# EAGLE design Plytka falownika (EAGLE 4.11)
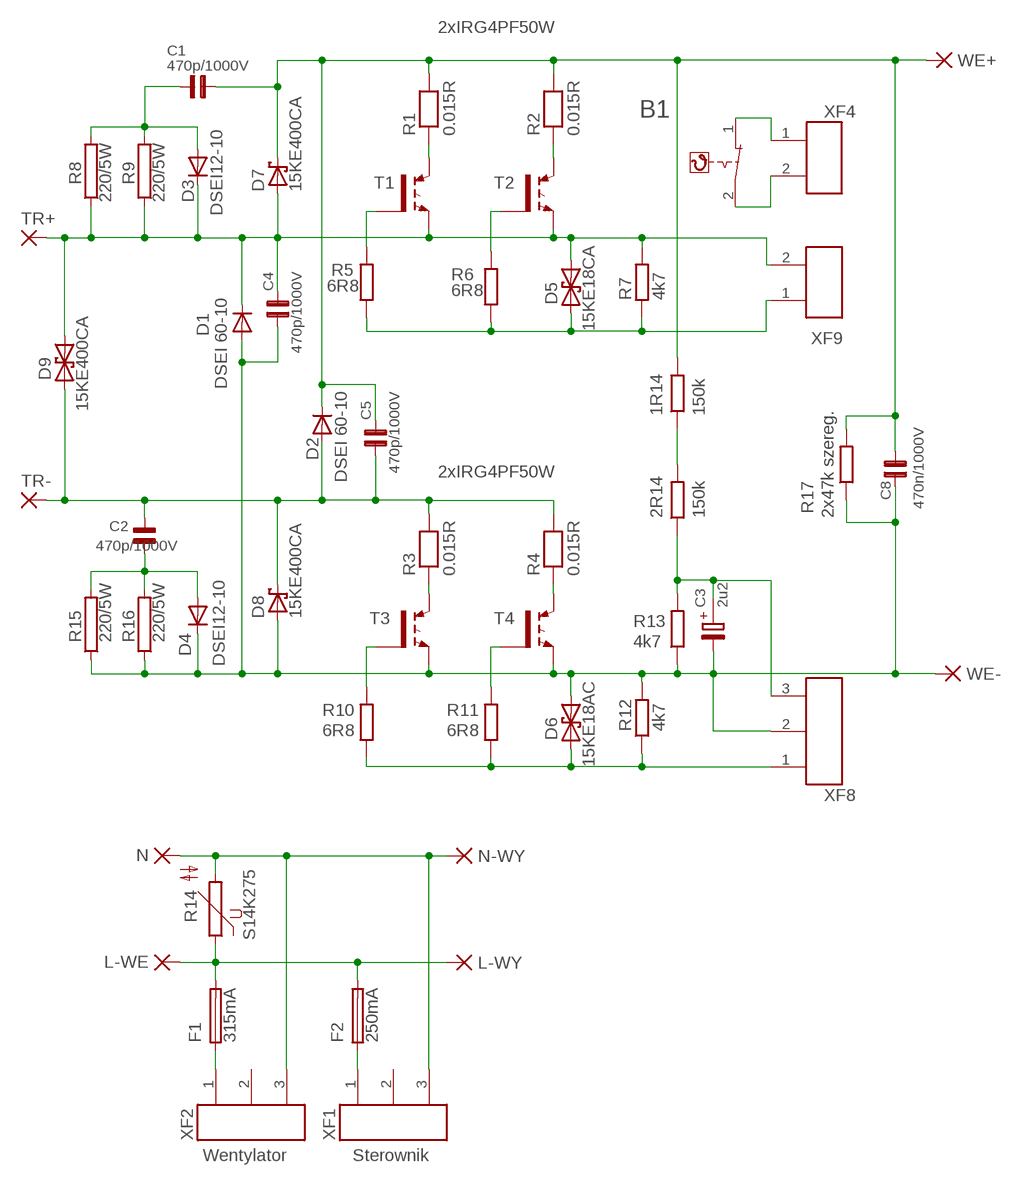
[diagram p0: schematic, sheet 1]

## Parts
1R14  150k  R-EU_0207/15  [0207/15]
2R14  150k  R-EU_0207/10  [0207/10]
B1  TGRENZ  [TGRENZ]
C1  470p/1000V  C15B5  [C15B5]
C2  470p/1000V  C15B5  [C15B5]
C3  2u2  E5-5  [E5-5]
C4  470p/1000V  C15B5  [C15B5]
C5  470p/1000V  C15B5  [C15B5]
C8  470n/1000V  C27,5B11  [C27,5B11]
D1  DSEI 60-10  DSEI60-10  [TO247AD]
D2  DSEI 60-10  DSEI60-10  [TO247AD]
D3  DSEI12-10  BYT08P  [TO220ACS]
D4  DSEI12-10  BYT08P  [TO220ACS]
D5  15KE18CA  15KEXXC  [CB429-17]
D6  15KE18AC  15KEXXC  [CB429-17]
D7  15KE400CA  15KEXX  [CB429-17]
D8  15KE400CA  15KEXX  [CB429-17]
D9  15KE400CA  15KEXXC  [CB429-17]
F1  315mA  SH22,5A  [SH22,5A]
F2  250mA  SH22,5A  [SH22,5A]
L-WE  PAD-0820  [0820]
L-WY  PAD-0820  [0820]
N  PAD-0820  [0820]
N-WY  PAD-0820  [0820]
R1  0.015R  R_BLASZ  [R_BLASZ]
R2  0.015R  R_BLASZ  [R_BLASZ]
R3  0.015R  R_BLASZ  [R_BLASZ]
R4  0.015R  R_BLASZ  [R_BLASZ]
R5  6R8  R-EU_0411/15  [0411/15]
R6  6R8  R-EU_0411/15  [0411/15]
R7  4k7  R-EU_0207/10  [0207/10]
R8  220/5W  3N2  [3N2ROYAL]
R9  220/5W  3N2  [3N2ROYAL]
R10  6R8  R-EU_0411/15  [0411/15]
R11  6R8  R-EU_0411/15  [0411/15]
R12  4k7  R-EU_0207/10  [0207/10]
R13  4k7  R-EU_0207/10  [0207/10]
R14  S14K275  [S14K275]
R15  220/5W  3N2  [3N2ROYAL]
R16  220/5W  3N2  [3N2ROYAL]
R17  2x47k szereg.  R-EU_0411/12  [0411/12]
T1  IRG4PH50U  [TO247BH]
T2  IRG4PH50U  [TO247BH]
T3  IRG4PH50U  [TO247BH]
T4  IRG4PH50U  [TO247BH]
TR+  M4_10X12  [M4_10X12]
TR-  M4_10X12  [M4_10X12]
WE+  PAD  [25X5]
WE-  PAD  [25X5]
XF1  Sterownik  ZK_3  [ZK_3]
XF2  Wentylator  ZK_3  [ZK_3]
XF4  ZK_2  [ZK_2]
XF8  ZK_3  [ZK_3]
XF9  ZK_2  [ZK_2]

## Nets
N$1: R1.1 T1.D-C(C)
N$2: R2.1 T2.D-C(C)
N$5: 1R14.2 C1.1 C5.2 C8.2 D2.K(C) D7.C R1.2 R2.2 R17.2 WE+.1(P)
N$6: C2.1 C5.1 D2.A D8.C D9.A R3.2 R4.2 TR-.1(P)
N$7: R3.1 T3.D-C(C)
N$8: R4.1 T4.D-C(C)
N$9: 1R14.1 2R14.2
N$10: C4.2 D1.K(C) D3.C D5.C D7.A D9.C R7.2 R8.1 R9.1 T1.S-E(E) T2.S-E(E) TR+.1(P) XF9.2
N$11: R10.2 T3.G
N$12: C2.2 D4.A R15.2 R16.2
N$13: C1.2 D3.A R8.2 R9.2
N$14: R11.2 T4.G
N$15: B1.2 XF4.2
N$16: D6.A R10.1 R11.1 R12.1 XF8.1
N$17: R5.2 T1.G
N$18: R6.2 T2.G
N$19: B1.1 XF4.1
N$20: F1.2 F2.2 L-WE.P$1(P) L-WY.P$1(P) R14.1
N$21: D5.A R5.1 R6.1 R7.1 XF9.1
N$22: N-WY.P$1(P) N.P$1(P) R14.2 XF1.3 XF2.3
N$23: 2R14.1 C3.+ R13.2 XF8.3
N$24: F1.1 XF2.1
N$25: F2.1 XF1.1
R17: C3.- C4.1 C8.1 D1.A D4.C D6.C D8.A R12.2 R13.1 R15.1 R16.1 R17.1 T3.S-E(E) T4.S-E(E) WE-.1(P) XF8.2
Unconnected: XF1.2 XF2.2

## Notes on the sheet
- 2xIRG4PF50W
- 2xIRG4PF50W

## Library data of the parts
1R14 2R14 R5-R7 R10-R13 R17 = rcl:R-EU_: RESISTOR, European symbol
B1 = ELEKTRIK:TGRENZ
C1 C2 C4 C5 = condensatory_2:C15B5
C3 = elektrolity:E5-5
C8 = condensatory_2:C27,5B11
D1 D2 = diode:DSEI60-10
D3 D4 = diode:BYT08P: DIODE ultra fast
D5 D6 D9 = diode:15KEXXC: DIODE
D7 D8 = diode:15KEXX: DIODE
F1 F2 = fuse:SH22,5A: FUSE HOLDER grid 22,5mm, isolated cap OGN0031 8201, Schurter (Buerklin)
L-WE L-WY N N-WY WE+ WE- = dpads:PAD: WIRE PAD Standard US Drill Sizes and SMD pads
R1-R4 = moje-elementy:R_BLASZ: Rezystor blaszkowy
R8 R9 R15 R16 = resistor-power:3N2
R14 = varistor:S14K275: VARISTOR
T1-T4 = transistor-power:IRG4PH50U: IRG4PH50 tranzystor IGBT ultra szybki do 40 kHz 40/24A 1200V
TR+ TR- = wirepad:M4_10X12
XF1 XF2 XF8 = moje-elementy:ZK_3
XF4 XF9 = moje-elementy:ZK_2

## Board
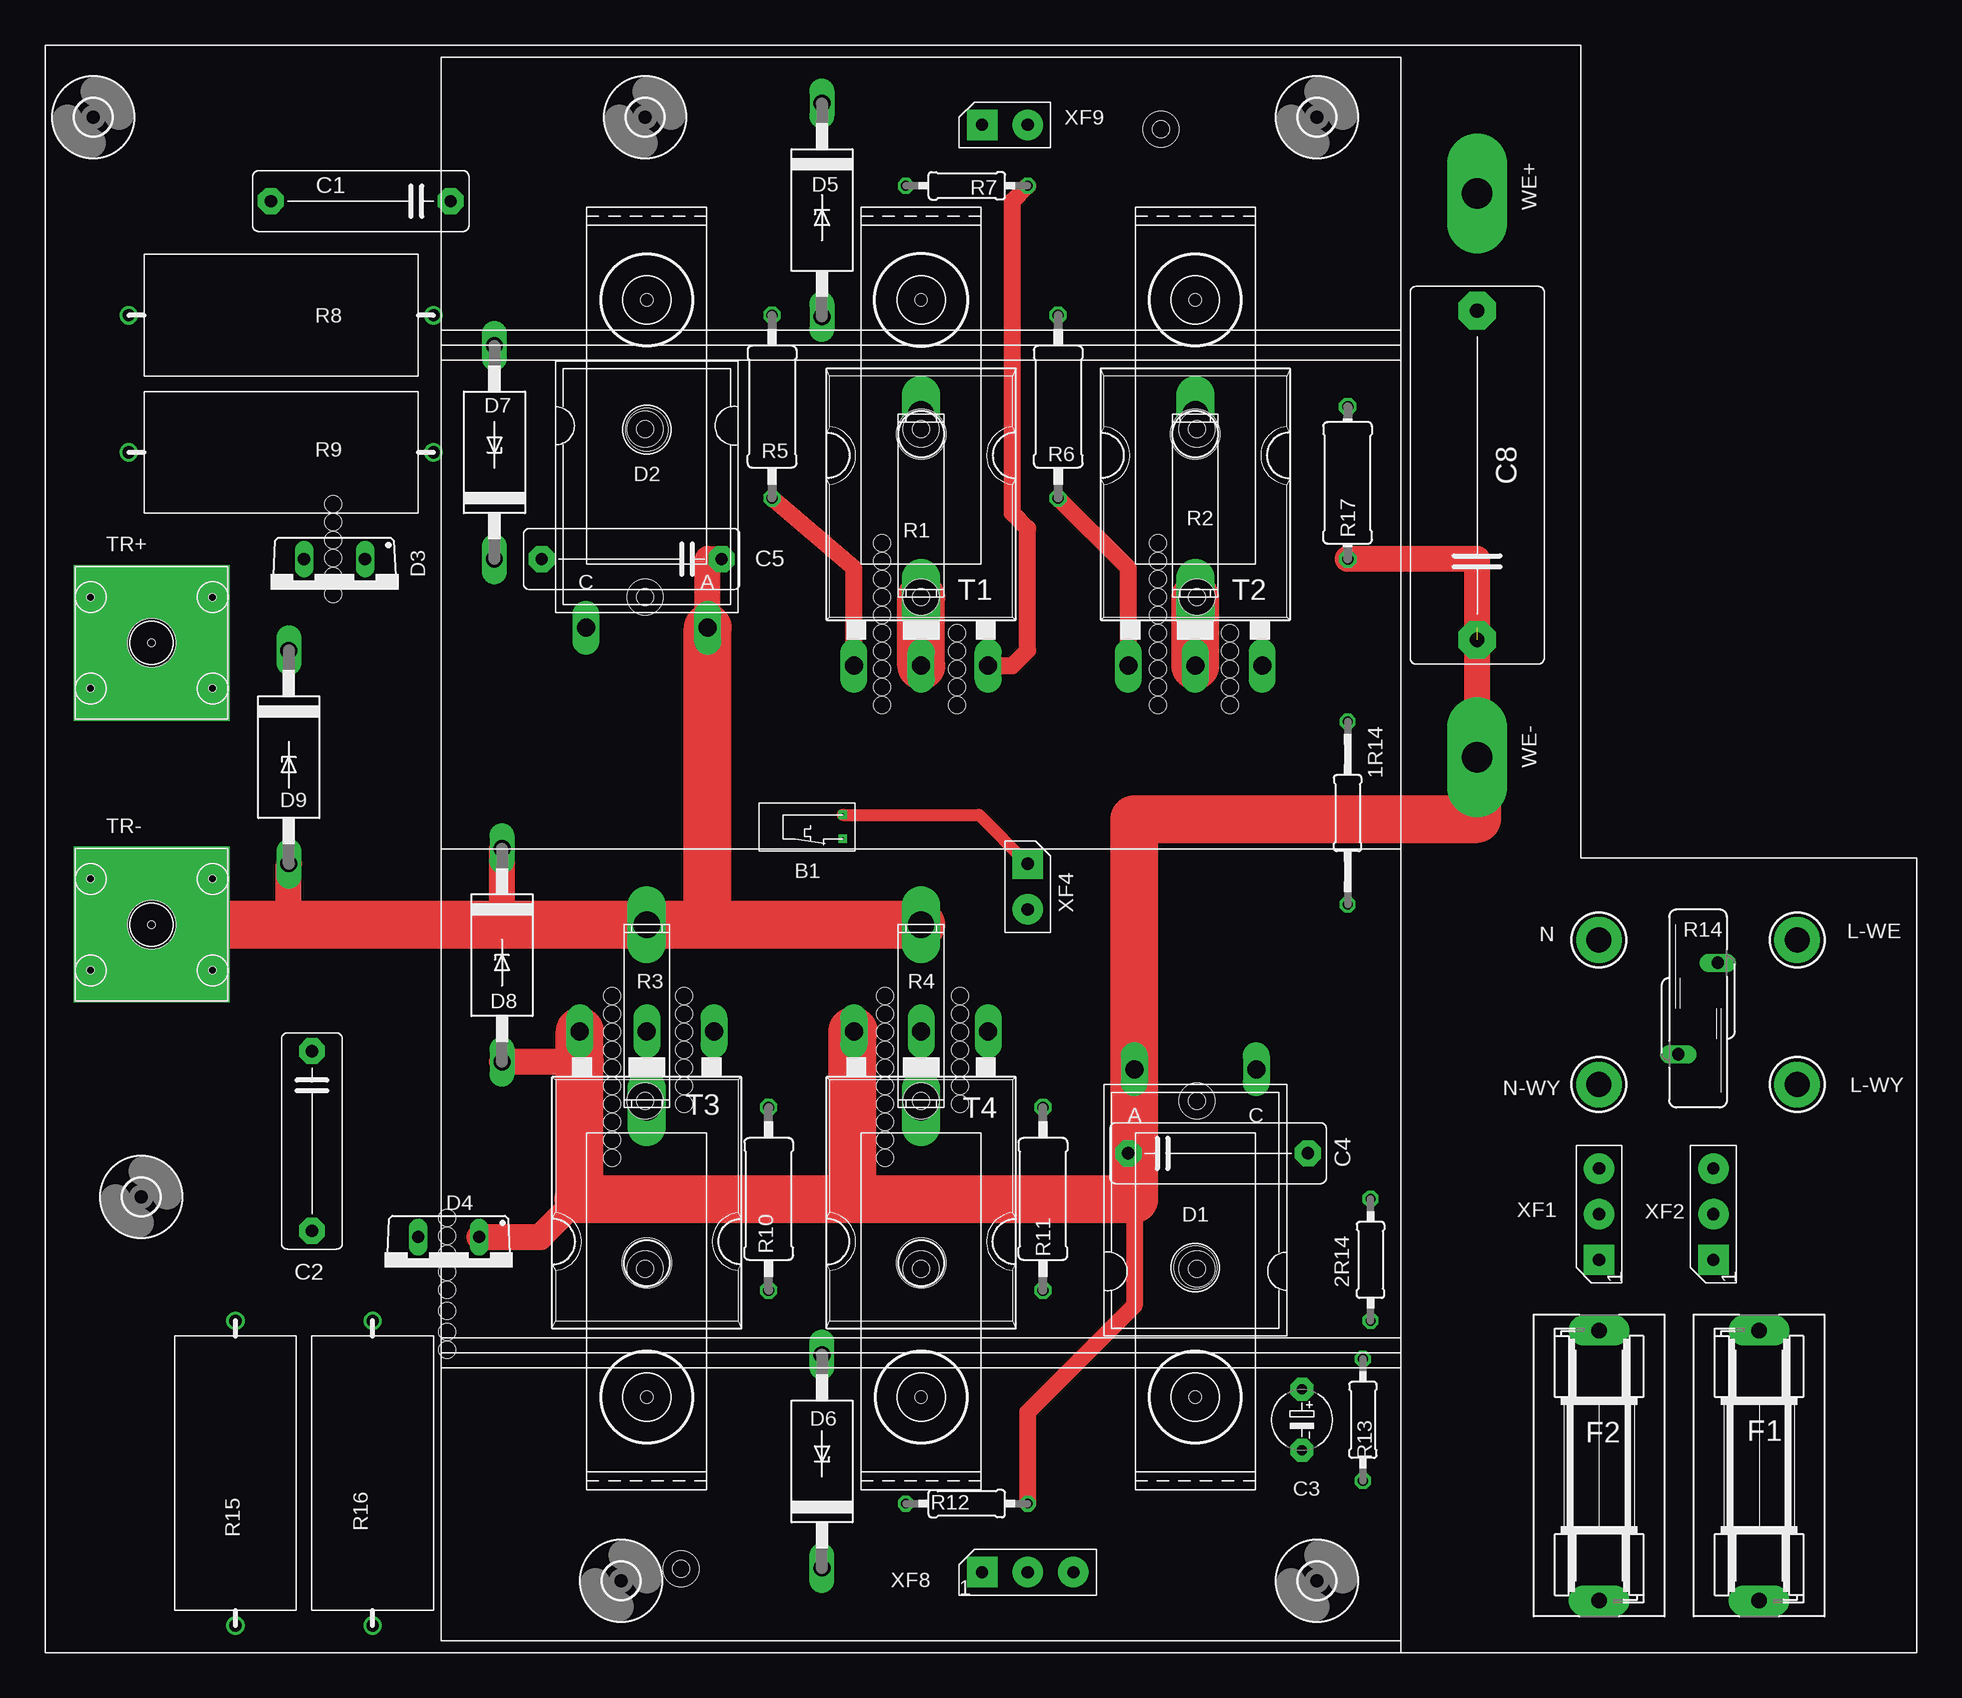
[diagram p1: board, top side]
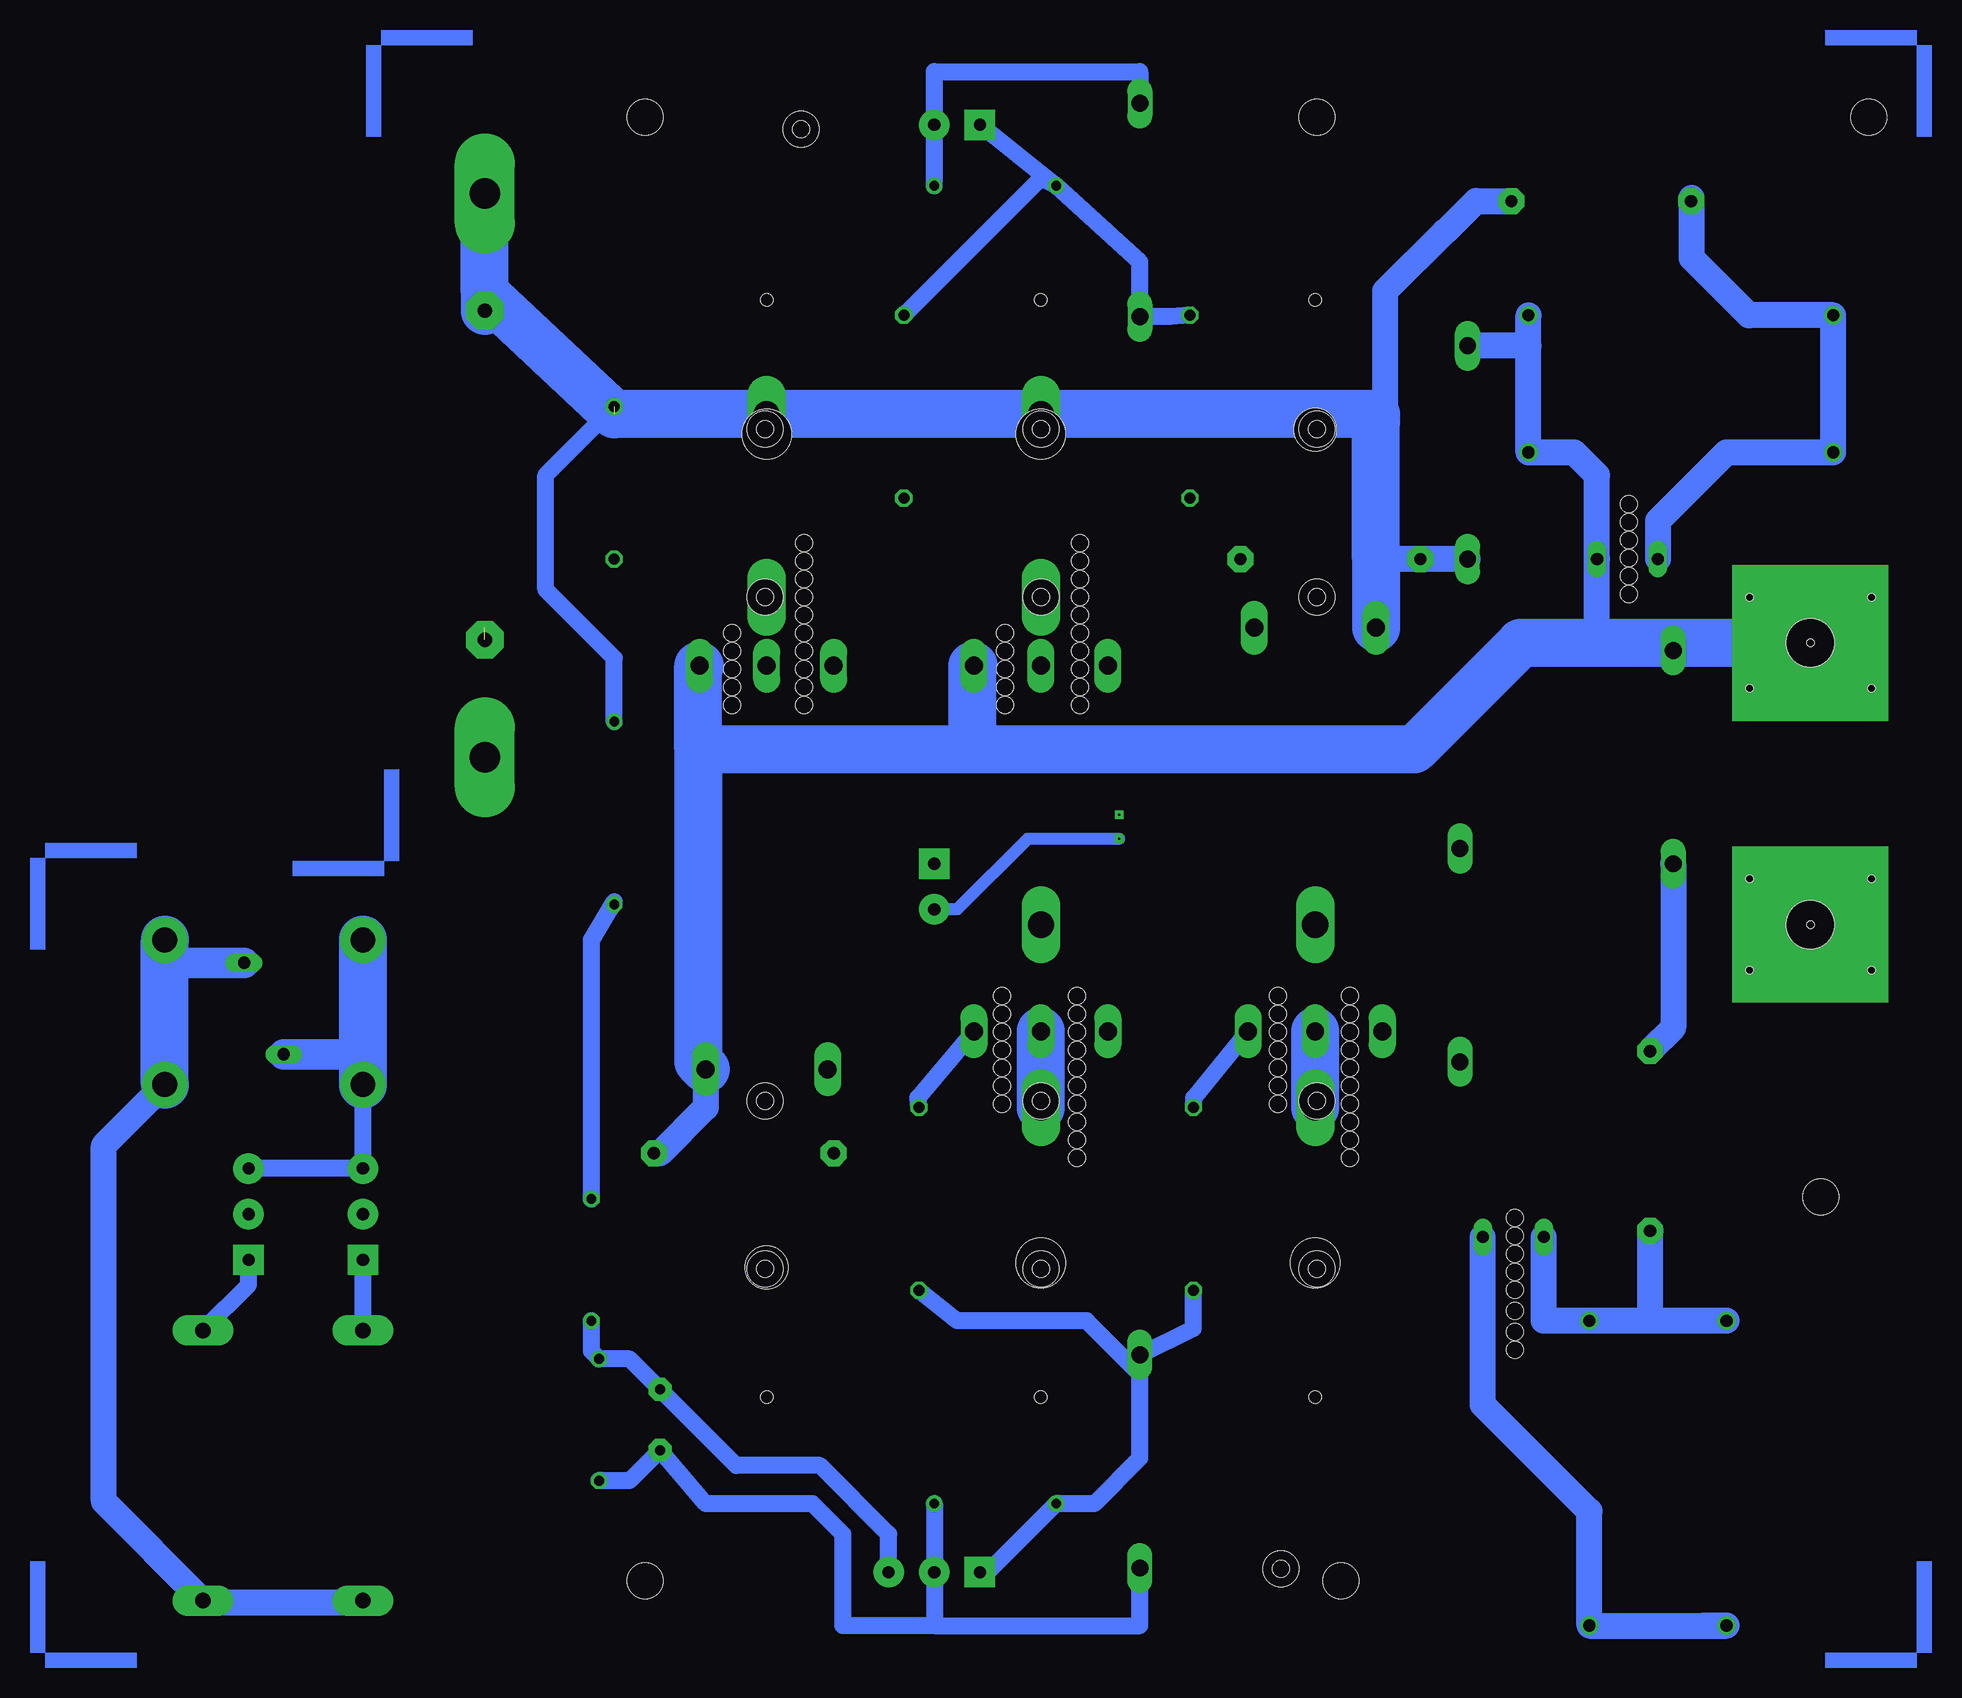
[diagram p2: board, bottom side, seen from below]

No outline drawn. Coordinates in mm, seen from the top.
Copper layers (1*16): Top 0.035mm / dielectric 1.5mm / Bottom 0.035mm
Design rules "default": minimum track width 10mil, minimum drill 24mil, track to track 8mil, track to pad 8mil, pad to pad 8mil, via to via 8mil, smd to smd 8mil, copper to edge 40mil, drill to drill 8mil, minimum pad ring 10mil, minimum via ring 8mil, stop-mask expansion 4mil, vias tented up to drill 0mil, thermal gap 10mil
Holes 1.42 mm at 36.75,81 36.75,82.5 36.75,79.5 43,81 43,79.5 43,82.5 36.75,84 36.75,85.5 36.75,87 36.75,88.5 36.75,90 36.75,91.5 36.75,78 43,78 43,84 59.75,81 59.75,82.5 59.75,84 59.75,85.5 59.75,87 59.75,88.5 59.75,90 59.75,91.5 59.75,79.5 59.75,78 65.75,81 65.75,79.5 65.75,78 65.75,82.5 65.75,84 14.25,50.75 14.25,52.25 14.25,53.75 14.25,49.25 14.25,47.75 14.25,46.25 14.25,44.75 14.25,43.25 14.25,41.75 14.25,40.25 20.25,50.75 20.25,52.25 20.25,53.75 20.25,49.25 20.25,47.75 20.25,46.25 20.25,44.75 37,50.75 37,52.25 37,53.75 37,49.25 37,47.75 37,46.25 37,44.75 37,43.25 37,41.75 37,40.25 43.25,50.75 43.25,52.25 43.25,53.75 43.25,49.25 43.25,47.75 43.25,46.25 43.25,44.75 -9,90.25 -9,91.75 -9,93.25 -9,94.75 -9,88.75 -9,87.25 0.5,33.75 0.5,35.25 0.5,32.25 0.5,30.75 0.5,29.25 0.5,27.5 0.5,25.75 0.5,24.25

### Footprints (pad centres in the part's own frame; a part is rotated, then mirrored left to right if it is on the bottom)
0207/15 = drill 0.813 octagon: 1 -7.62,0; 2 7.62,0
0207/10 = drill 0.813 octagon: 1 -5.08,0; 2 5.08,0
TGRENZ = drill 0.2 pad 0.4 square: 1 1,3; 2 3,3
C15B5 = drill 1.016 pad 2.159 octagon: 1 -7.493,0; 2 7.493,0
E5-5 = drill 0.813 pad 1.905 octagon: + -2.54,0; - 2.54,0
C27,5B11 = drill 1.194 pad 3.15 octagon: 1 -13.716,0; 2 13.716,0
TO247AD = drill 1.5 long: A 5.08,-16.51; K -5.08,-16.51 | hole 3.55: 0,0
TO220ACS = drill 1.016 long: A 2.54,-2.54; C -2.54,-2.54
CB429-17 = drill 1.397 long: A 8.89,0; C -8.89,0
SH22,5A = drill 1.321 pad 2.54 long: 1 -11.252,0; 2 11.252,0
0820 = drill 2.083 pad 3.81 round: P$1 0,0
R_BLASZ = drill 2.184 long: 1 -7.62,0; 2 7.62,0
0411/15 = drill 0.914 octagon: 1 -7.62,0; 2 7.62,0
3N2ROYAL = drill 1.016 round: 1 -12.7,0; 2 12.7,0
S14K275 = drill 1.016 long: 1 -1.651,-3.81; 2 1.651,3.81
0411/12 = drill 0.914 octagon: 1 -6.35,0; 2 6.35,0
TO247BH = drill 1.499 long: D-C 0,-10.16; G -5.588,-10.16; S-E 5.588,-10.16 | hole 4.115: 0,9.144
M4_10X12 = drill 4 pad 13 square: 1 0,0 | hole 4: 0,0 | hole 0.61: -5.08,3.81; 5.08,3.81; -5.08,-3.81; 5.08,-3.81; 0,0
RAD80X66 = hole 1.422: -17,21; -17,35; -40,21; -40,35; -63,21; -63,35; -20,60 | hole 3: -17,35; -17,21; -40,21; -63,21; -63,35; -40,35; -20,60
SPINKA = hole 1.016: 0,0
3,0 = hole 3: 0,0
25X5 = drill 2.54 pad 5 long: 1 0,0
ZK_3 = drill 1.016 pad 2.54 square: 1 -3.81,0 | drill 1.016 pad 2.54 round: 2 0,0; 3 3.81,0
ZK_2 = drill 1.016 pad 2.54 square: 1 -3.81,0 | drill 1.016 pad 2.54 round: 2 0,0

### Placement (x,y rotation side)
1R14  75.56,69 90 top
2R14  77.47,31.75 90 top
B1  30.48,69.85 270 top
C1  -6.7,120.01 180 top
C2  -10.77,41.66 270 top
C3  71.75,18.41 270 top
C4  64.77,40.64 0 top
C5  15.88,90.17 180 top
C8  86.36,97.16 90 top
D1  62.87,31.11 180 top
D2  17.14,100.97 0 top
D3  -8.89,87.63 180 top
D4  0.64,31.11 180 top
D5  31.75,119.27 270 top
D6  31.75,14.95 90 top
D7  4.45,99.06 90 top
D8  5.08,57.15 270 top
D9  -12.7,73.66 270 top
F1  109.86,14.61 270 top
F2  96.52,14.61 270 top
L-WE  113.03,58.42 0 top
L-WY  113.03,46.35 0 top
N  96.52,58.42 0 top
N-WY  96.52,46.35 0 top
R1  40.01,94.61 90 top
R2  62.87,94.61 90 top
R3  17.14,52.07 90 top
R4  40.01,52.07 90 top
R5  27.57,102.87 270 top
R6  51.44,102.87 270 top
R7  43.81,121.28 0 top
R8  -13.34,110.49 180 top
R9  -13.34,99.06 180 top
R10  27.3,36.83 90 top
R11  50.16,36.83 90 top
R12  43.81,11.43 0 top
R13  76.83,18.41 90 top
R14  104.78,52.7 180 top
R15  -17.14,13.97 90 top
R16  -5.71,13.97 90 top
R17  75.56,96.52 90 top
T1  40.01,91.44 0 top
T2  62.87,91.44 0 top
T3  17.14,40.64 180 top
T4  40.01,40.64 180 top
TR+  -24.13,83.19 0 top
TR-  -24.13,59.69 0 top
U$1  [RAD80X66]  0,66 180 top
U$2  [RAD80X66]  80,66 0 top
U$3  [SPINKA]  17.14,20.32 0 top
U$4  [SPINKA]  40.01,20.32 0 top
U$5  [SPINKA]  62.87,20.32 0 top
U$6  [SPINKA]  17.14,111.76 180 top
U$7  [SPINKA]  40.01,111.76 180 top
U$8  [SPINKA]  62.87,111.76 180 top
U$9  [3,0]  -29,127 0 top
U$10  [3,0]  17,127 0 top
U$11  [3,0]  73,127 0 top
U$12  [3,0]  73,5 0 top
U$13  [3,0]  15,5 0 top
U$14  [3,0]  -25,37 0 top
U$15  [ANGLE-ARROW-NW1]  -33,-1 90 top
U$16  [ANGLE-ARROW-SE1]  123,65.25 90 top
U$17  [ANGLE-ARROW-SE1]  123,-1 0 top
U$18  [ANGLE-ARROW-SE1]  95,133 90 top
U$19  [ANGLE-ARROW-SE1]  -33,133 180 top
U$20  [ANGLE-ARROW-SE1]  94.75,65 270 top
WE+  86.36,120.65 90 top
WE-  86.36,73.66 90 top
XF1  96.52,35.56 90 top
XF2  106.05,35.56 90 top
XF4  48.9,60.96 270 top
XF8  48.9,5.71 0 top
XF9  48.9,126.36 0 top

### Tracks (layer width: path | path; a pad name or v marks a point on that pad's centre or on a via)
N$1
  Top 4: T1.D-C R1.1
N$2
  Top 4: T2.D-C R2.1
N$5  (1 unrouted)
  Bottom 1.422: 1R14.2 75.56,81.92 81.28,87.63 81.28,97.16 R17.2
  Bottom 2.184: 12.06,90.17 C5.2 D7.C | 12.06,101.6 11.43,101.6 11.43,102.23 11.3,102.23 11.3,112.52 6.35,117.47 6.28,117.47 3.74,120.01 C1.1
  Bottom 4: D2.K 12.06,90.17 12.06,101.6 12.06,102.23 R1.2 R2.2 75.56,102.23 86.36,112.39 | 86.36,112.39 C8.2 | 86.36,112.39 WE+.1
N$6
  Top 2.184: D2.A 22.23,90.17 C5.1 | 5.08,59.69 D8.C | D9.A -12.7,60.33 -12.06,59.69 -1.95,59.69
  Top 4: 22.23,59.69 R3.2 5.08,59.69 -1.95,59.69 TR-.1 | 22.23,59.69 R4.2 | 22.23,59.69 D2.A
  Bottom 2.184: C2.1 -12.7,51.08 D9.A
N$7
  Bottom 4: R3.1 T3.D-C
N$8
  Bottom 4: R4.1 T4.D-C
N$9
  Bottom 1.422: 1R14.1 75.56,61.59 77.47,58.42 2R14.2
N$10  (via drill 0.61)
  Top 1.422: v45.72,81.28 47.62,81.28 48.9,82.55 48.9,92.71 47.62,93.98 47.62,120.02 R7.2
  Bottom 1.422: D5.C 31.75,130.81 48.9,130.81 XF9.2 R7.2
  Bottom 2.184: C4.2 71.75,40.64 67.94,44.45 D1.K | -0.64,107.95 R9.1 -4.45,99.06 -6.35,97.16 D3.C -6.35,83.82 -6.99,83.19 | -0.64,107.95 R8.1 | -0.64,107.95 D7.A | -12.7,83.19 D9.C
  Bottom 4: T2.S-E 68.58,81.28 68.58,74.3 | T1.S-E v45.72,81.28 45.72,74.3 | 45.72,74.3 68.58,74.3 | 68.58,74.3 68.58,48.26 D1.K | 45.72,74.3 8.89,74.3 0,83.19 -6.99,83.19 -12.7,83.19 TR+.1
N$11
  Bottom 1.422: R10.2 27.25,45.25 T3.G
N$12
  Bottom 2.184: D4.A -1.91,26.67 R16.2 -10.79,26.67 | -10.79,26.67 R15.2 -15.33,26.67 | C2.2 -10.79,34.17 -10.79,26.67
N$13
  Bottom 2.184: C1.2 -14.19,120.19 -14.25,120.25 -14.25,115.25 -19.01,110.49 R8.2 R9.2 -17.14,99.06 -11.43,93.34 D3.A
N$14
  Bottom 1.422: R11.2 50.25,45.25 T4.G
N$15
  Bottom 1.016: B1.2 41.1,66.85 46.99,60.96 XF4.2
N$16
  Bottom 1.422: 31.75,22.23 31.75,15.24 35.56,11.43 R12.1 44.45,5.71 XF8.1 | R10.1 27.3,26.04 D6.A 31.75,22.23 | 31.75,22.23 36.2,26.67 46.99,26.67 R11.1
N$17
  Top 1.422: T1.G 34.42,89.41 R5.2
N$18
  Top 1.422: T2.G 57.28,89.41 R6.2
N$19
  Top 1.016: B1.1 44.81,68.85 XF4.1
N$20
  Bottom 2.184: F2.2 96.7,3.17 109.86,3.17 F1.2 118.11,11.61 118.11,41.27 L-WY.P$1
  Bottom 2.54: 113.03,56.52 R14.1
  Bottom 4: L-WY.P$1 113.03,56.52 L-WE.P$1
N$21
  Bottom 1.422: R5.1 29.21,110.38 D5.A 31.75,114.94 R7.1 | R7.1 40.01,121.92 R6.1 | R7.1 XF9.1
N$22
  Bottom 1.422: N-WY.P$1 XF1.3 XF2.3
  Bottom 2.54: 96.52,48.9 R14.2
  Bottom 4: N-WY.P$1 96.52,48.9 N.P$1
N$23
  Bottom 1.422: XF8.3 52.7,8.89 58.42,14.61 65.41,14.61 C3.+ 74.3,23.5 R13.2 77.47,24.13 2R14.1
N$24
  Bottom 1.422: F1.1 106.05,29.67 XF2.1
N$25
  Bottom 1.422: F2.1 XF1.1
R17  (1 unrouted)
  Top 1.422: 57.78,36.83 57.78,27.94 48.9,19.05 R12.2
  Top 2.184: R17.1 86.36,90.17 86.36,84.45 WE-.1 | C4.1 57.28,37.59 57.15,37.47 57.15,36.83 | 11.56,48.26 D8.A | 11.43,36.83 8.26,33.66 D4.C
  Top 4: T3.S-E 11.56,48.26 11.56,36.96 11.43,36.83 34.29,36.83 | T4.S-E 34.29,50.8 34.29,36.83 | 34.29,36.83 57.15,36.83 57.78,36.83 | 57.78,36.83 D1.A | 57.78,36.83 57.78,68.5 78.11,68.5 86.36,68.5 WE-.1
  Bottom 1.422: R13.1 74.3,13.34 C3.- 67.94,11.43 59.05,11.43 56.52,8.89 56.52,1.27 48.9,1.27 | R12.2 XF8.2 48.9,1.27 | D6.C 31.75,1.27 48.9,1.27
  Bottom 2.184: -15.27,1.27 R15.1 R16.1 -5.71,10.79 3.17,19.68 D4.C